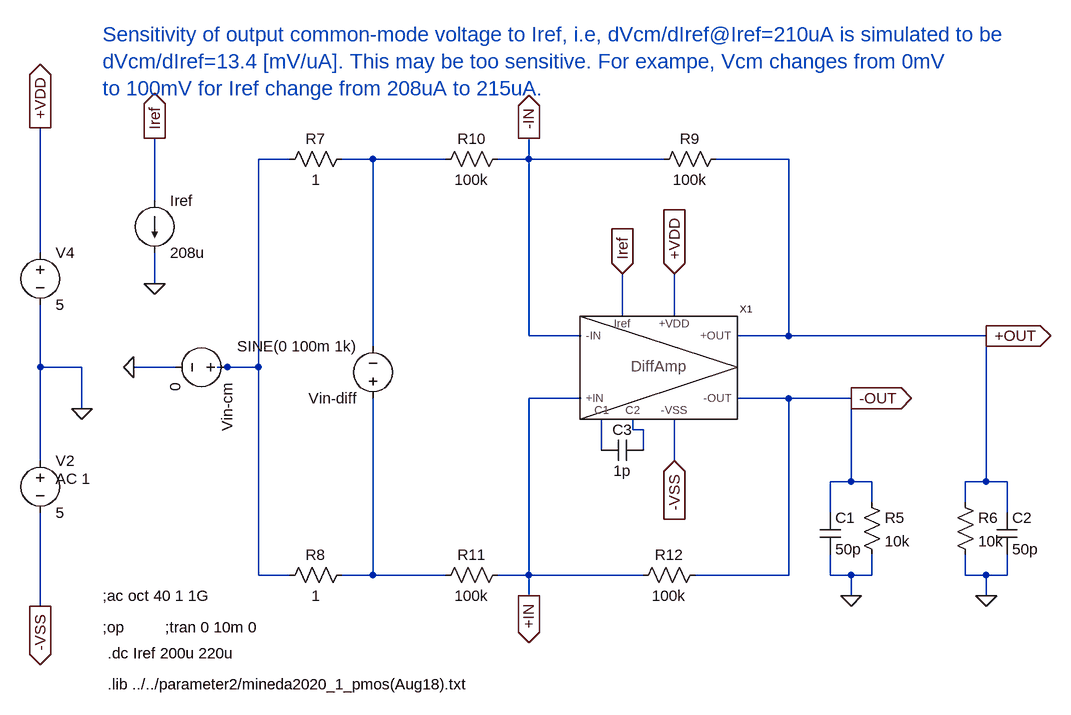
[diagram p0: schematic mmm-CMoutSensitivity.asc]
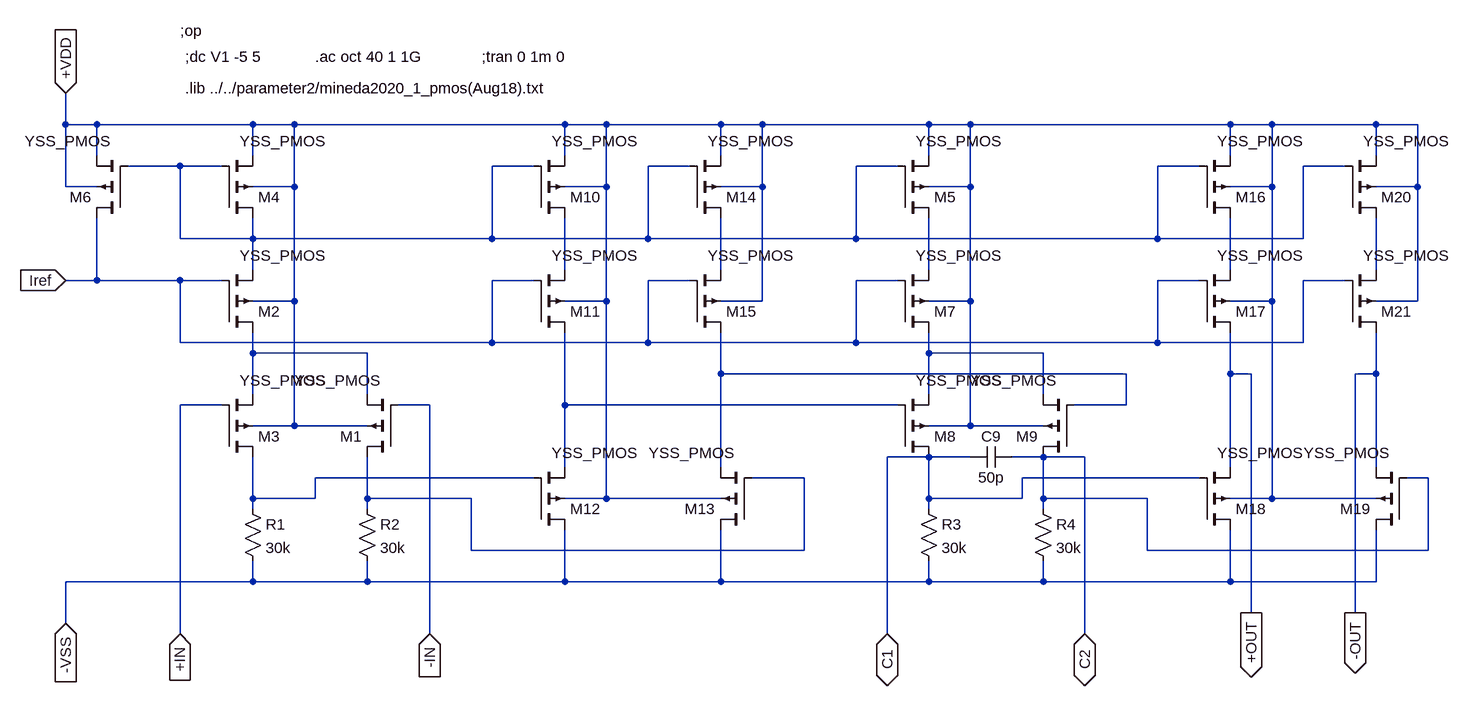
[diagram p1: sub-circuit diffamp.asc]
mmm-CMoutSensitivity.asc, the LTspice schematic file:
Version 4
SHEET 1 2296 2968
WIRE -48 -976 -96 -976
WIRE 80 -976 32 -976
WIRE 192 -976 80 -976
WIRE 320 -976 320 -1008
WIRE 320 -976 272 -976
WIRE 528 -976 320 -976
WIRE 720 -976 608 -976
WIRE -256 -912 -256 -1008
WIRE -432 -832 -432 -1024
WIRE -256 -784 -256 -832
WIRE 464 -736 464 -800
WIRE 544 -736 544 -800
WIRE 320 -704 320 -976
WIRE 400 -704 320 -704
WIRE 720 -704 720 -976
WIRE 720 -704 640 -704
WIRE 1024 -704 720 -704
WIRE 80 -688 80 -976
WIRE -432 -656 -432 -752
WIRE -368 -656 -432 -656
WIRE -224 -656 -288 -656
WIRE -144 -656 -160 -656
WIRE -96 -656 -96 -976
WIRE -96 -656 -144 -656
WIRE 400 -608 320 -608
WIRE 720 -608 640 -608
WIRE 816 -608 720 -608
WIRE -368 -592 -368 -656
WIRE 480 -560 480 -576
WIRE 496 -560 480 -560
WIRE 432 -528 432 -576
WIRE 496 -528 496 -560
WIRE -432 -512 -432 -656
WIRE 544 -512 544 -576
WIRE 816 -480 816 -608
WIRE 816 -480 784 -480
WIRE 848 -480 816 -480
WIRE 1024 -480 1024 -704
WIRE 1024 -480 992 -480
WIRE 1056 -480 1024 -480
WIRE 848 -448 848 -480
WIRE 992 -448 992 -480
WIRE 784 -432 784 -480
WIRE 1056 -432 1056 -480
WIRE -96 -336 -96 -656
WIRE -48 -336 -96 -336
WIRE 80 -336 80 -608
WIRE 80 -336 32 -336
WIRE 192 -336 80 -336
WIRE 320 -336 320 -608
WIRE 320 -336 272 -336
WIRE 496 -336 320 -336
WIRE 720 -336 720 -608
WIRE 720 -336 576 -336
WIRE 784 -336 784 -368
WIRE 816 -336 784 -336
WIRE 848 -336 848 -368
WIRE 848 -336 816 -336
WIRE 992 -336 992 -368
WIRE 1024 -336 992 -336
WIRE 1056 -336 1056 -368
WIRE 1056 -336 1024 -336
WIRE 320 -304 320 -336
WIRE 816 -304 816 -336
WIRE 1024 -304 1024 -336
WIRE -432 -288 -432 -432
FLAG -256 -784 0
FLAG -368 -592 0
FLAG 816 -304 0
FLAG 1024 -304 0
FLAG -432 -1024 +VDD
IOPIN -432 -1024 Out
FLAG -432 -288 -VSS
IOPIN -432 -288 Out
FLAG -256 -1008 Iref
IOPIN -256 -1008 Out
FLAG 816 -608 -OUT
IOPIN 816 -608 Out
FLAG 1024 -704 +OUT
IOPIN 1024 -704 Out
FLAG -288 -656 0
FLAG 320 -304 +IN
IOPIN 320 -304 Out
FLAG 320 -1008 -IN
IOPIN 320 -1008 Out
FLAG 544 -800 +VDD
IOPIN 544 -800 In
FLAG 544 -512 -VSS
IOPIN 544 -512 In
FLAG 464 -800 Iref
IOPIN 464 -800 In
SYMBOL current -256 -912 R0
WINDOW 123 0 0 Left 2
WINDOW 39 0 0 Left 2
SYMATTR InstName Iref
SYMATTR Value 208u
SYMBOL voltage 80 -592 R180
WINDOW 123 24 124 Left 2
WINDOW 39 0 0 Left 2
SYMATTR Value SINE(0 100m 1k)
SYMATTR InstName Vin-diff
SYMBOL voltage -432 -528 R0
WINDOW 123 24 44 Left 2
WINDOW 39 0 0 Left 2
SYMATTR Value2 AC 1
SYMATTR InstName V2
SYMATTR Value 5
SYMBOL res 832 -464 R0
SYMATTR InstName R5
SYMATTR Value 10k
SYMBOL res 976 -464 R0
SYMATTR InstName R6
SYMATTR Value 10k
SYMBOL voltage -432 -848 R0
WINDOW 123 24 44 Left 2
WINDOW 39 0 0 Left 2
SYMATTR InstName V4
SYMATTR Value 5
SYMBOL res -64 -960 R270
WINDOW 0 32 56 VTop 2
WINDOW 3 0 56 VBottom 2
SYMATTR InstName R7
SYMATTR Value 1
SYMBOL res -64 -320 R270
WINDOW 0 32 56 VTop 2
WINDOW 3 0 56 VBottom 2
SYMATTR InstName R8
SYMATTR Value 1
SYMBOL cap 768 -432 R0
SYMATTR InstName C1
SYMATTR Value 50p
SYMBOL cap 1040 -432 R0
SYMATTR InstName C2
SYMATTR Value 50p
SYMBOL voltage -128 -656 R90
WINDOW 123 24 124 Left 2
WINDOW 39 0 0 Left 2
SYMATTR InstName Vin-cm
SYMATTR Value 0
SYMBOL res 624 -992 R90
WINDOW 0 0 56 VBottom 2
WINDOW 3 32 56 VTop 2
SYMATTR InstName R9
SYMATTR Value 100k
SYMBOL res 288 -992 R90
WINDOW 0 0 56 VBottom 2
WINDOW 3 32 56 VTop 2
SYMATTR InstName R10
SYMATTR Value 100k
SYMBOL res 288 -352 R90
WINDOW 0 0 56 VBottom 2
WINDOW 3 32 56 VTop 2
SYMATTR InstName R11
SYMATTR Value 100k
SYMBOL res 592 -352 R90
WINDOW 0 0 56 VBottom 2
WINDOW 3 32 56 VTop 2
SYMATTR InstName R12
SYMATTR Value 100k
SYMBOL cap 496 -544 R90
WINDOW 0 0 32 VBottom 2
WINDOW 3 32 32 VTop 2
SYMATTR InstName C3
SYMATTR Value 1p
SYMBOL DiffAmp 464 -656 R0
SYMATTR InstName X1
TEXT -328 -216 Left 2 !.dc Iref 200u 220u 
TEXT -328 -168 Left 2 !.lib ../../parameter2/mineda2020_1_pmos(Aug18).txt
TEXT -336 -256 Left 2 !;op
TEXT -336 -304 Left 2 !;ac oct 40 1 1G
TEXT -240 -256 Left 2 !;tran 0 10m 0
TEXT -336 -1168 Left 3 ;Sensitivity of output common-mode voltage to Iref, i.e, dVcm/dIref@Iref=210uA is simulated to be\ndVcm/dIref=13.4 [mV/uA]. This may be too sensitive. For exampe, Vcm changes from 0mV\nto 100mV for Iref change from 208uA to 215uA.

diffamp.asc, the sub-circuit schematic file:
Version 4
SHEET 1 2296 2968
WIRE -384 -864 -384 -912
WIRE -336 -864 -384 -864
WIRE -96 -864 -336 -864
WIRE -32 -864 -96 -864
WIRE 384 -864 -32 -864
WIRE 448 -864 384 -864
WIRE 624 -864 448 -864
WIRE 688 -864 624 -864
WIRE 944 -864 688 -864
WIRE 1008 -864 944 -864
WIRE 1408 -864 1008 -864
WIRE 1472 -864 1408 -864
WIRE 1632 -864 1472 -864
WIRE 1696 -864 1632 -864
WIRE -336 -816 -336 -864
WIRE -96 -816 -96 -864
WIRE 384 -816 384 -864
WIRE 624 -816 624 -864
WIRE 944 -816 944 -864
WIRE 1408 -816 1408 -864
WIRE 1632 -816 1632 -864
WIRE -208 -800 -288 -800
WIRE -144 -800 -208 -800
WIRE 336 -800 272 -800
WIRE 576 -800 512 -800
WIRE 896 -800 832 -800
WIRE 1360 -800 1296 -800
WIRE 1584 -800 1520 -800
WIRE -384 -768 -384 -864
WIRE -336 -768 -384 -768
WIRE -32 -768 -32 -864
WIRE -32 -768 -96 -768
WIRE 448 -768 448 -864
WIRE 448 -768 384 -768
WIRE 688 -768 688 -864
WIRE 688 -768 624 -768
WIRE 1008 -768 1008 -864
WIRE 1008 -768 944 -768
WIRE 1472 -768 1472 -864
WIRE 1472 -768 1408 -768
WIRE 1696 -768 1696 -864
WIRE 1696 -768 1632 -768
WIRE -208 -688 -208 -800
WIRE -96 -688 -96 -720
WIRE -96 -688 -208 -688
WIRE 272 -688 272 -800
WIRE 272 -688 -96 -688
WIRE 512 -688 512 -800
WIRE 512 -688 272 -688
WIRE 832 -688 832 -800
WIRE 832 -688 512 -688
WIRE 1296 -688 1296 -800
WIRE 1296 -688 832 -688
WIRE 1520 -688 1520 -800
WIRE 1520 -688 1296 -688
WIRE -96 -640 -96 -688
WIRE 384 -640 384 -720
WIRE 624 -640 624 -720
WIRE 944 -640 944 -720
WIRE 1408 -640 1408 -720
WIRE 1632 -640 1632 -720
WIRE -336 -624 -336 -720
WIRE -336 -624 -384 -624
WIRE -208 -624 -336 -624
WIRE -144 -624 -208 -624
WIRE 336 -624 272 -624
WIRE 576 -624 512 -624
WIRE 896 -624 832 -624
WIRE 1360 -624 1296 -624
WIRE 1584 -624 1520 -624
WIRE -32 -592 -32 -768
WIRE -32 -592 -96 -592
WIRE 448 -592 448 -768
WIRE 448 -592 384 -592
WIRE 688 -592 688 -768
WIRE 688 -592 624 -592
WIRE 1008 -592 1008 -768
WIRE 1008 -592 944 -592
WIRE 1472 -592 1472 -768
WIRE 1472 -592 1408 -592
WIRE 1696 -592 1696 -768
WIRE 1696 -592 1632 -592
WIRE -208 -528 -208 -624
WIRE 272 -528 272 -624
WIRE 272 -528 -208 -528
WIRE 512 -528 512 -624
WIRE 512 -528 272 -528
WIRE 832 -528 832 -624
WIRE 832 -528 512 -528
WIRE 1296 -528 1296 -624
WIRE 1296 -528 832 -528
WIRE 1520 -528 1520 -624
WIRE 1520 -528 1296 -528
WIRE -96 -512 -96 -544
WIRE 80 -512 -96 -512
WIRE 944 -512 944 -544
WIRE 1120 -512 944 -512
WIRE 624 -480 624 -544
WIRE 1248 -480 624 -480
WIRE 1408 -480 1408 -544
WIRE 1440 -480 1408 -480
WIRE 1632 -480 1632 -544
WIRE 1632 -480 1600 -480
WIRE -96 -448 -96 -512
WIRE 80 -448 80 -512
WIRE 944 -448 944 -512
WIRE 1120 -448 1120 -512
WIRE -144 -432 -208 -432
WIRE 176 -432 128 -432
WIRE 384 -432 384 -544
WIRE 896 -432 384 -432
WIRE 1248 -432 1248 -480
WIRE 1248 -432 1168 -432
WIRE -32 -400 -32 -592
WIRE -32 -400 -96 -400
WIRE 80 -400 -32 -400
WIRE 1008 -400 1008 -592
WIRE 1008 -400 944 -400
WIRE 1120 -400 1008 -400
WIRE 944 -352 880 -352
WIRE 1008 -352 944 -352
WIRE 1120 -352 1072 -352
WIRE 1184 -352 1120 -352
WIRE 384 -336 384 -432
WIRE 624 -336 624 -480
WIRE 1408 -336 1408 -480
WIRE 1632 -336 1632 -480
WIRE 336 -320 0 -320
WIRE 752 -320 672 -320
WIRE 1360 -320 1088 -320
WIRE 1712 -320 1680 -320
WIRE -96 -288 -96 -352
WIRE 0 -288 0 -320
WIRE 0 -288 -96 -288
WIRE 80 -288 80 -352
WIRE 240 -288 80 -288
WIRE 448 -288 448 -592
WIRE 448 -288 384 -288
WIRE 624 -288 448 -288
WIRE 944 -288 944 -352
WIRE 1088 -288 1088 -320
WIRE 1088 -288 944 -288
WIRE 1120 -288 1120 -352
WIRE 1280 -288 1120 -288
WIRE 1472 -288 1472 -592
WIRE 1472 -288 1408 -288
WIRE 1632 -288 1472 -288
WIRE -96 -272 -96 -288
WIRE 80 -272 80 -288
WIRE 944 -272 944 -288
WIRE 1120 -272 1120 -288
WIRE 240 -208 240 -288
WIRE 752 -208 752 -320
WIRE 752 -208 240 -208
WIRE 1280 -208 1280 -288
WIRE 1712 -208 1712 -320
WIRE 1712 -208 1280 -208
WIRE -96 -160 -96 -192
WIRE -96 -160 -384 -160
WIRE 80 -160 80 -192
WIRE 80 -160 -96 -160
WIRE 384 -160 384 -240
WIRE 384 -160 80 -160
WIRE 624 -160 624 -240
WIRE 624 -160 384 -160
WIRE 944 -160 944 -192
WIRE 944 -160 624 -160
WIRE 1120 -160 1120 -192
WIRE 1120 -160 944 -160
WIRE 1408 -160 1408 -240
WIRE 1408 -160 1120 -160
WIRE 1632 -160 1632 -240
WIRE 1632 -160 1408 -160
WIRE 1440 -112 1440 -480
WIRE 1600 -112 1600 -480
WIRE -384 -96 -384 -160
WIRE -208 -80 -208 -432
WIRE 176 -80 176 -432
WIRE 880 -80 880 -352
WIRE 1184 -80 1184 -352
FLAG 1600 -112 -OUT
IOPIN 1600 -112 Out
FLAG 1440 -112 +OUT
IOPIN 1440 -112 Out
FLAG -384 -912 +VDD
IOPIN -384 -912 In
FLAG -384 -96 -VSS
IOPIN -384 -96 In
FLAG -384 -624 Iref
IOPIN -384 -624 In
FLAG -208 -80 +IN
IOPIN -208 -80 In
FLAG 176 -80 -IN
IOPIN 176 -80 In
FLAG 880 -80 C1
IOPIN 880 -80 BiDir
FLAG 1184 -80 C2
IOPIN 1184 -80 BiDir
SYMBOL pmos4 -288 -720 R180
WINDOW 3 28 118 Left 2
SYMATTR Value YSS_PMOS
SYMATTR InstName M6
SYMATTR Value2 l=14u w=280u ad=3.92n as=3.92n pd=308u ps=308u
SYMBOL pmos4 -144 -544 M180
WINDOW 3 28 118 Left 2
SYMATTR Value YSS_PMOS
SYMATTR InstName M2
SYMATTR Value2 l=14u w=84u ad=1.176n as=1.176n pd=112u ps=112u
SYMBOL pmos4 -144 -352 M180
WINDOW 3 28 118 Left 2
SYMATTR Value YSS_PMOS
SYMATTR InstName M3
SYMATTR Value2 l=10u w=200u ad=2.0n as=2.0n pd=220u ps=220u
SYMBOL res -112 -288 R0
SYMATTR InstName R1
SYMATTR Value 30k
SYMBOL res 64 -288 R0
SYMATTR InstName R2
SYMATTR Value 30k
SYMBOL res 928 -288 R0
SYMATTR InstName R3
SYMATTR Value 30k
SYMBOL res 1104 -288 R0
SYMATTR InstName R4
SYMATTR Value 30k
SYMBOL pmos4 -144 -720 M180
WINDOW 3 28 118 Left 2
SYMATTR Value YSS_PMOS
SYMATTR InstName M4
SYMATTR Value2 l=14u w=280u ad=3.92n as=3.92n pd=308u ps=308u
SYMBOL pmos4 896 -720 M180
WINDOW 3 28 118 Left 2
SYMATTR Value YSS_PMOS
SYMATTR InstName M5
SYMATTR Value2 l=14u w=280u ad=3.92n as=3.92n pd=308u ps=308u
SYMBOL pmos4 896 -544 M180
WINDOW 3 28 118 Left 2
SYMATTR Value YSS_PMOS
SYMATTR InstName M7
SYMATTR Value2 l=14u w=84u ad=1.176n as=1.176n pd=112u ps=112u
SYMBOL pmos4 896 -352 M180
WINDOW 3 28 118 Left 2
SYMATTR Value YSS_PMOS
SYMATTR InstName M8
SYMATTR Value2 l=10u w=200u ad=2.0n as=2.0n pd=220u ps=220u
SYMBOL pmos4 128 -352 R180
WINDOW 3 28 118 Left 2
SYMATTR Value YSS_PMOS
SYMATTR InstName M1
SYMATTR Value2 l=10u w=200u ad=2.0n as=2.0n pd=220u ps=220u
SYMBOL pmos4 1168 -352 R180
WINDOW 3 28 118 Left 2
SYMATTR Value YSS_PMOS
SYMATTR InstName M9
SYMATTR Value2 l=10u w=200u ad=2.0n as=2.0n pd=220u ps=220u
SYMBOL pmos4 336 -720 M180
WINDOW 3 28 118 Left 2
SYMATTR Value YSS_PMOS
SYMATTR InstName M10
SYMATTR Value2 l=14u w=280u ad=3.92n as=3.92n pd=308u ps=308u
SYMBOL pmos4 336 -544 M180
WINDOW 3 28 118 Left 2
SYMATTR Value YSS_PMOS
SYMATTR InstName M11
SYMATTR Value2 l=14u w=84u ad=1.176n as=1.176n pd=112u ps=112u
SYMBOL pmos4 336 -240 M180
WINDOW 3 28 118 Left 2
SYMATTR Value YSS_PMOS
SYMATTR InstName M12
SYMATTR Value2 l=10u w=200u ad=2.0n as=2.0n pd=220u ps=220u
SYMBOL pmos4 672 -240 R180
WINDOW 3 28 118 Left 2
SYMATTR Value YSS_PMOS
SYMATTR InstName M13
SYMATTR Value2 l=10u w=200u ad=2.0n as=2.0n pd=220u ps=220u
SYMBOL pmos4 576 -720 M180
WINDOW 3 28 118 Left 2
SYMATTR Value YSS_PMOS
SYMATTR InstName M14
SYMATTR Value2 l=14u w=280u ad=3.92n as=3.92n pd=308u ps=308u
SYMBOL pmos4 576 -544 M180
WINDOW 3 28 118 Left 2
SYMATTR Value YSS_PMOS
SYMATTR InstName M15
SYMATTR Value2 l=14u w=84u ad=1.176n as=1.176n pd=112u ps=112u
SYMBOL pmos4 1360 -720 M180
WINDOW 3 28 118 Left 2
SYMATTR Value YSS_PMOS
SYMATTR InstName M16
SYMATTR Value2 l=14u w=280u ad=3.92n as=3.92n pd=308u ps=308u m=4
SYMBOL pmos4 1360 -544 M180
WINDOW 3 28 118 Left 2
SYMATTR Value YSS_PMOS
SYMATTR InstName M17
SYMATTR Value2 l=14u w=84u ad=1.176n as=1.176n pd=112u ps=112u m=4
SYMBOL pmos4 1360 -240 M180
WINDOW 3 28 118 Left 2
SYMATTR Value YSS_PMOS
SYMATTR InstName M18
SYMATTR Value2 l=10u w=200u ad=2.0n as=2.0n pd=220u ps=220u m=4
SYMBOL pmos4 1680 -240 R180
WINDOW 3 28 118 Left 2
SYMATTR Value YSS_PMOS
SYMATTR InstName M19
SYMATTR Value2 l=10u w=200u ad=2.0n as=2.0n pd=220u ps=220u m=4
SYMBOL pmos4 1584 -720 M180
WINDOW 3 28 118 Left 2
SYMATTR Value YSS_PMOS
SYMATTR InstName M20
SYMATTR Value2 l=14u w=280u ad=3.92n as=3.92n pd=308u ps=308u m=4
SYMBOL pmos4 1584 -544 M180
WINDOW 3 28 118 Left 2
SYMATTR Value YSS_PMOS
SYMATTR InstName M21
SYMATTR Value2 l=14u w=84u ad=1.176n as=1.176n pd=112u ps=112u m=4
SYMBOL cap 1072 -368 R90
WINDOW 0 0 32 VBottom 2
WINDOW 3 32 32 VTop 2
SYMATTR InstName C9
SYMATTR Value 50p
TEXT -200 -968 Left 2 !;dc V1 -5 5
TEXT -200 -920 Left 2 !.lib ../../parameter2/mineda2020_1_pmos(Aug18).txt
TEXT -208 -1008 Left 2 !;op
TEXT 0 -968 Left 2 !.ac oct 40 1 1G
TEXT 256 -968 Left 2 !;tran 0 1m 0

The netlist it stands for:
* mmm-CMoutSensitivity.asc
Iref Iref 0 208u
Vin-diff N005 N002 SINE(0 100m 1k)
V2 0 -VSS 5 AC 1
R5 -OUT 0 10k
R6 +OUT 0 10k
V4 +VDD 0 5
R7 N001 N002 1
R8 N001 N005 1
C1 -OUT 0 50p
C2 +OUT 0 50p
Vin-cm N001 0 0
R9 +OUT -IN 100k
R10 -IN N002 100k
R11 +IN N005 100k
R12 -OUT +IN 100k
C3 N003 N004 1p
XX1 +IN -IN -OUT +OUT +VDD -VSS N004 N003 Iref diffamp

* block symbol definitions
.subckt diffamp +IN -IN -OUT +OUT +VDD -VSS C1 C2 Iref
M6 Iref N001 +VDD +VDD YSS_PMOS l=14u w=280u ad=3.92n as=3.92n pd=308u ps=308u
M2 N007 Iref N001 +VDD YSS_PMOS l=14u w=84u ad=1.176n as=1.176n pd=112u ps=112u
M3 N011 +IN N007 +VDD YSS_PMOS l=10u w=200u ad=2.0n as=2.0n pd=220u ps=220u
R1 N011 -VSS 30k
R2 N012 -VSS 30k
R3 C1 -VSS 30k
R4 C2 -VSS 30k
M4 N001 N001 +VDD +VDD YSS_PMOS l=14u w=280u ad=3.92n as=3.92n pd=308u ps=308u
M5 N004 N001 +VDD +VDD YSS_PMOS l=14u w=280u ad=3.92n as=3.92n pd=308u ps=308u
M7 N008 Iref N004 +VDD YSS_PMOS l=14u w=84u ad=1.176n as=1.176n pd=112u ps=112u
M8 C1 N010 N008 +VDD YSS_PMOS l=10u w=200u ad=2.0n as=2.0n pd=220u ps=220u
M1 N012 -IN N007 +VDD YSS_PMOS l=10u w=200u ad=2.0n as=2.0n pd=220u ps=220u
M9 C2 N009 N008 +VDD YSS_PMOS l=10u w=200u ad=2.0n as=2.0n pd=220u ps=220u
M10 N002 N001 +VDD +VDD YSS_PMOS l=14u w=280u ad=3.92n as=3.92n pd=308u ps=308u
M11 N010 Iref N002 +VDD YSS_PMOS l=14u w=84u ad=1.176n as=1.176n pd=112u ps=112u
M12 -VSS N011 N010 +VDD YSS_PMOS l=10u w=200u ad=2.0n as=2.0n pd=220u ps=220u
M13 -VSS N012 N009 +VDD YSS_PMOS l=10u w=200u ad=2.0n as=2.0n pd=220u ps=220u
M14 N003 N001 +VDD +VDD YSS_PMOS l=14u w=280u ad=3.92n as=3.92n pd=308u ps=308u
M15 N009 Iref N003 +VDD YSS_PMOS l=14u w=84u ad=1.176n as=1.176n pd=112u ps=112u
M16 N005 N001 +VDD +VDD YSS_PMOS l=14u w=280u ad=3.92n as=3.92n pd=308u ps=308u m=4
M17 +OUT Iref N005 +VDD YSS_PMOS l=14u w=84u ad=1.176n as=1.176n pd=112u ps=112u m=4
M18 -VSS C1 +OUT +VDD YSS_PMOS l=10u w=200u ad=2.0n as=2.0n pd=220u ps=220u m=4
M19 -VSS C2 -OUT +VDD YSS_PMOS l=10u w=200u ad=2.0n as=2.0n pd=220u ps=220u m=4
M20 N006 N001 +VDD +VDD YSS_PMOS l=14u w=280u ad=3.92n as=3.92n pd=308u ps=308u m=4
M21 -OUT Iref N006 +VDD YSS_PMOS l=14u w=84u ad=1.176n as=1.176n pd=112u ps=112u m=4
C9 C2 C1 50p
;dc V1 -5 5
.lib ../../parameter2/mineda2020_1_pmos(Aug18).txt
;op
.ac oct 40 1 1G
;tran 0 1m 0
.ends diffamp

.model NMOS NMOS
.model PMOS PMOS
.lib standard.mos
.dc Iref 200u 220u
.lib ../../parameter2/mineda2020_1_pmos(Aug18).txt
;op
;ac oct 40 1 1G
;tran 0 10m 0
* Sensitivity of output common-mode voltage to Iref, i.e, dVcm/dIref@Iref=210uA is simulated to be
* dVcm/dIref=13.4 [mV/uA]. This may be too sensitive. For exampe, Vcm changes from 0mV
* to 100mV for Iref change from 208uA to 215uA.
.backanno
.end